# Altium schematic sheet leo_FLOORSEN.SchDoc
size 209 x 229 mm; SheetNumber: 5; SheetTotal: 5
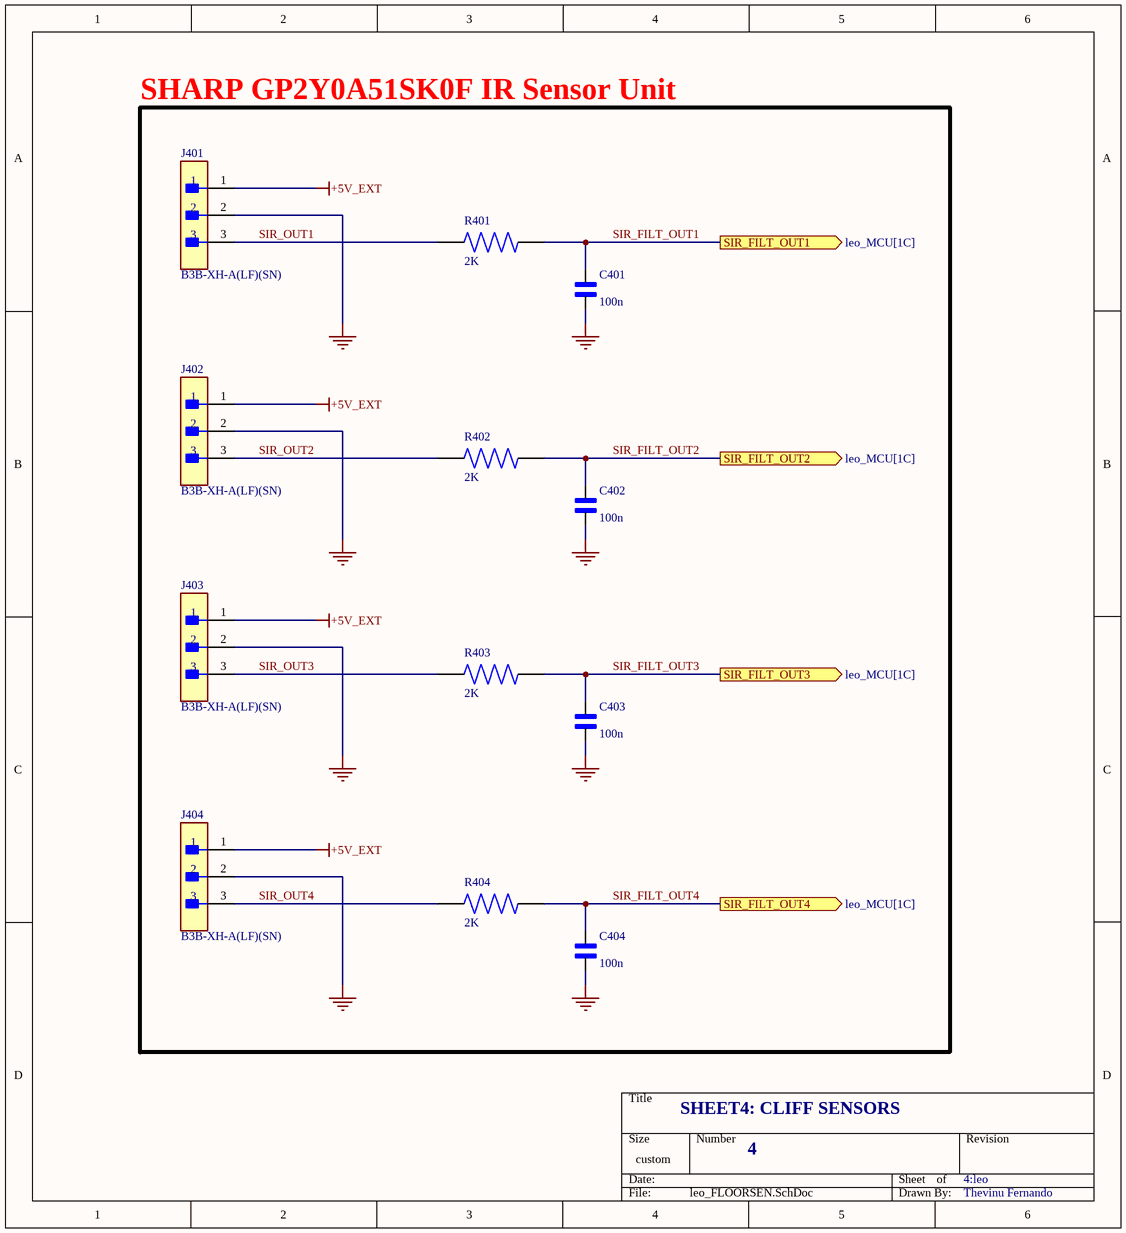
[diagram p0: leo_FLOORSEN.SchDoc]

## Parts
C401  100n  [CAP_0402]
C402  100n  [CAP_0402]
C403  100n  [CAP_0402]
C404  100n  [CAP_0402]
J401  B3B-XH-A(LF)(SN)  [FP-B3B-XH-A_LF_SN-MFG]
J402  B3B-XH-A(LF)(SN)  [FP-B3B-XH-A_LF_SN-MFG]
J403  B3B-XH-A(LF)(SN)  [FP-B3B-XH-A_LF_SN-MFG]
J404  B3B-XH-A(LF)(SN)  [FP-B3B-XH-A_LF_SN-MFG]
R401  2K  [RES_0402]
R402  2K  [RES_0402]
R403  2K  [RES_0402]
R404  2K  [RES_0402]

## Blocks framed on the sheet
SHARP GP2Y0A51SK0F IR Sensor Unit: C401-C404 J401-J404 R401-R404

## Ports
SIR_FILT_OUT1 (out, see leo_MCU[1C]), SIR_FILT_OUT2 (out, see leo_MCU[1C]), SIR_FILT_OUT3 (out, see leo_MCU[1C]), SIR_FILT_OUT4 (out, see leo_MCU[1C])

## Nets
+5V_EXT: J401.1 J402.1 J403.1 J404.1
GND: C401.1 C402.1 C403.1 C404.1 J401.2 J402.2 J403.2 J404.2
SIR_FILT_OUT1: C401.2 R401.2 ; port SIR_FILT_OUT1
SIR_FILT_OUT2: C402.2 R402.2 ; port SIR_FILT_OUT2
SIR_FILT_OUT3: C403.2 R403.2 ; port SIR_FILT_OUT3
SIR_FILT_OUT4: C404.2 R404.2 ; port SIR_FILT_OUT4
SIR_OUT1: J401.3 R401.1
SIR_OUT2: J402.3 R402.1
SIR_OUT3: J403.3 R403.1
SIR_OUT4: J404.3 R404.1

## Notes on the sheet
- SHEET4: CLIFF SENSORS
- 4
- 4:leo
- Thevinu Fernando

## Library data of the parts
C401-C404 = CAP_0402: Ceramic Capacitor X7R 0402 (1005 Metric); MF: Samsung; MP: CL05B104KO5NNNC; SnapEDA_Link: https://www.snapeda.com/parts/CL05B104KO5NNNC/Samsung/view-part/?ref=snap; Package: SMD-2 Samsung; Value: *; Check_prices: https://www.snapeda.com/parts/CL05B104KO5NNNC/Samsung/view-part/?ref=eda
J401-J404 = B3B-XH-A(LF)(SN): CONN HEADER VERT 3POS 2.5MM; Max Voltage Rating (DC): 250V; Number of Positions: 3; Current Rating: 3A; Gender: Male; Wire/Cable Gauge: 22AWG; Contact Resistance: 20mR; Insulation Resistance: 1GR; Insulation Material: Nylon; Contact Plating: Tin; Depth: 5.75mm; Contact Type: Male Pin; Max Operating Temperature: 85°C; Insulation Color: Natural; Voltage Rating (AC): 250V; Color: Natural; Connector Type: Header; Orientation: Straight; Fastening Type: Detent; Housing Color: White; Min Operating Temperature: -25°C; Termination: Solder; Voltage Rating: 250V; Series: XH; Pitch: 2.5mm; Contact Shape: Square; Number of Rows: 1; Lead Free: Lead Free; Packaging: Bulk; Mount: Through Hole; Flammability Rating: UL94 V-0; Max Voltage Rating (AC): 250V; REACH SVHC: No SVHC; Housing Material: Polyamide; Contact Material: Brass; Lead Pitch: 2.5mm; Contact Finish - Mating: TIN; Length: 9.9mm; Max Current Rating: 3A; Number of Contacts: 3
R401-R404 = RES_0402: Chip Resistor 0402 (1005 Metric) Automotive AEC-Q200 Thick Film; MF: Panasonic; MP: ERJ-2RKF1002X; Package: 1005-2 Panasonic; Price: None; Check_prices: https://www.snapeda.com/parts/ERJ-2RKF1002X/Panasonic%20Electronic%20Components/view-part/78636/?ref=eda; Value: *; SnapEDA_Link: https://www.snapeda.com/parts/ERJ-2RKF1002X/Panasonic%20Electronic%20Components/view-part/78636/?ref=snap; Availability: In Stock